# EasyEDA Pro project can-mcu.eprj, schematic host-dimmer-rgbw
Board Name: host-dimmer-rgbw; Create Date: 2026-08-16; Page Name: P1; Project Name: can-mcu; Schematic Name: host-dimmer-rgbw; Update Date: 2026-09-08; Company: EasyEDA.com; Page Size: A4; Version: V1.0
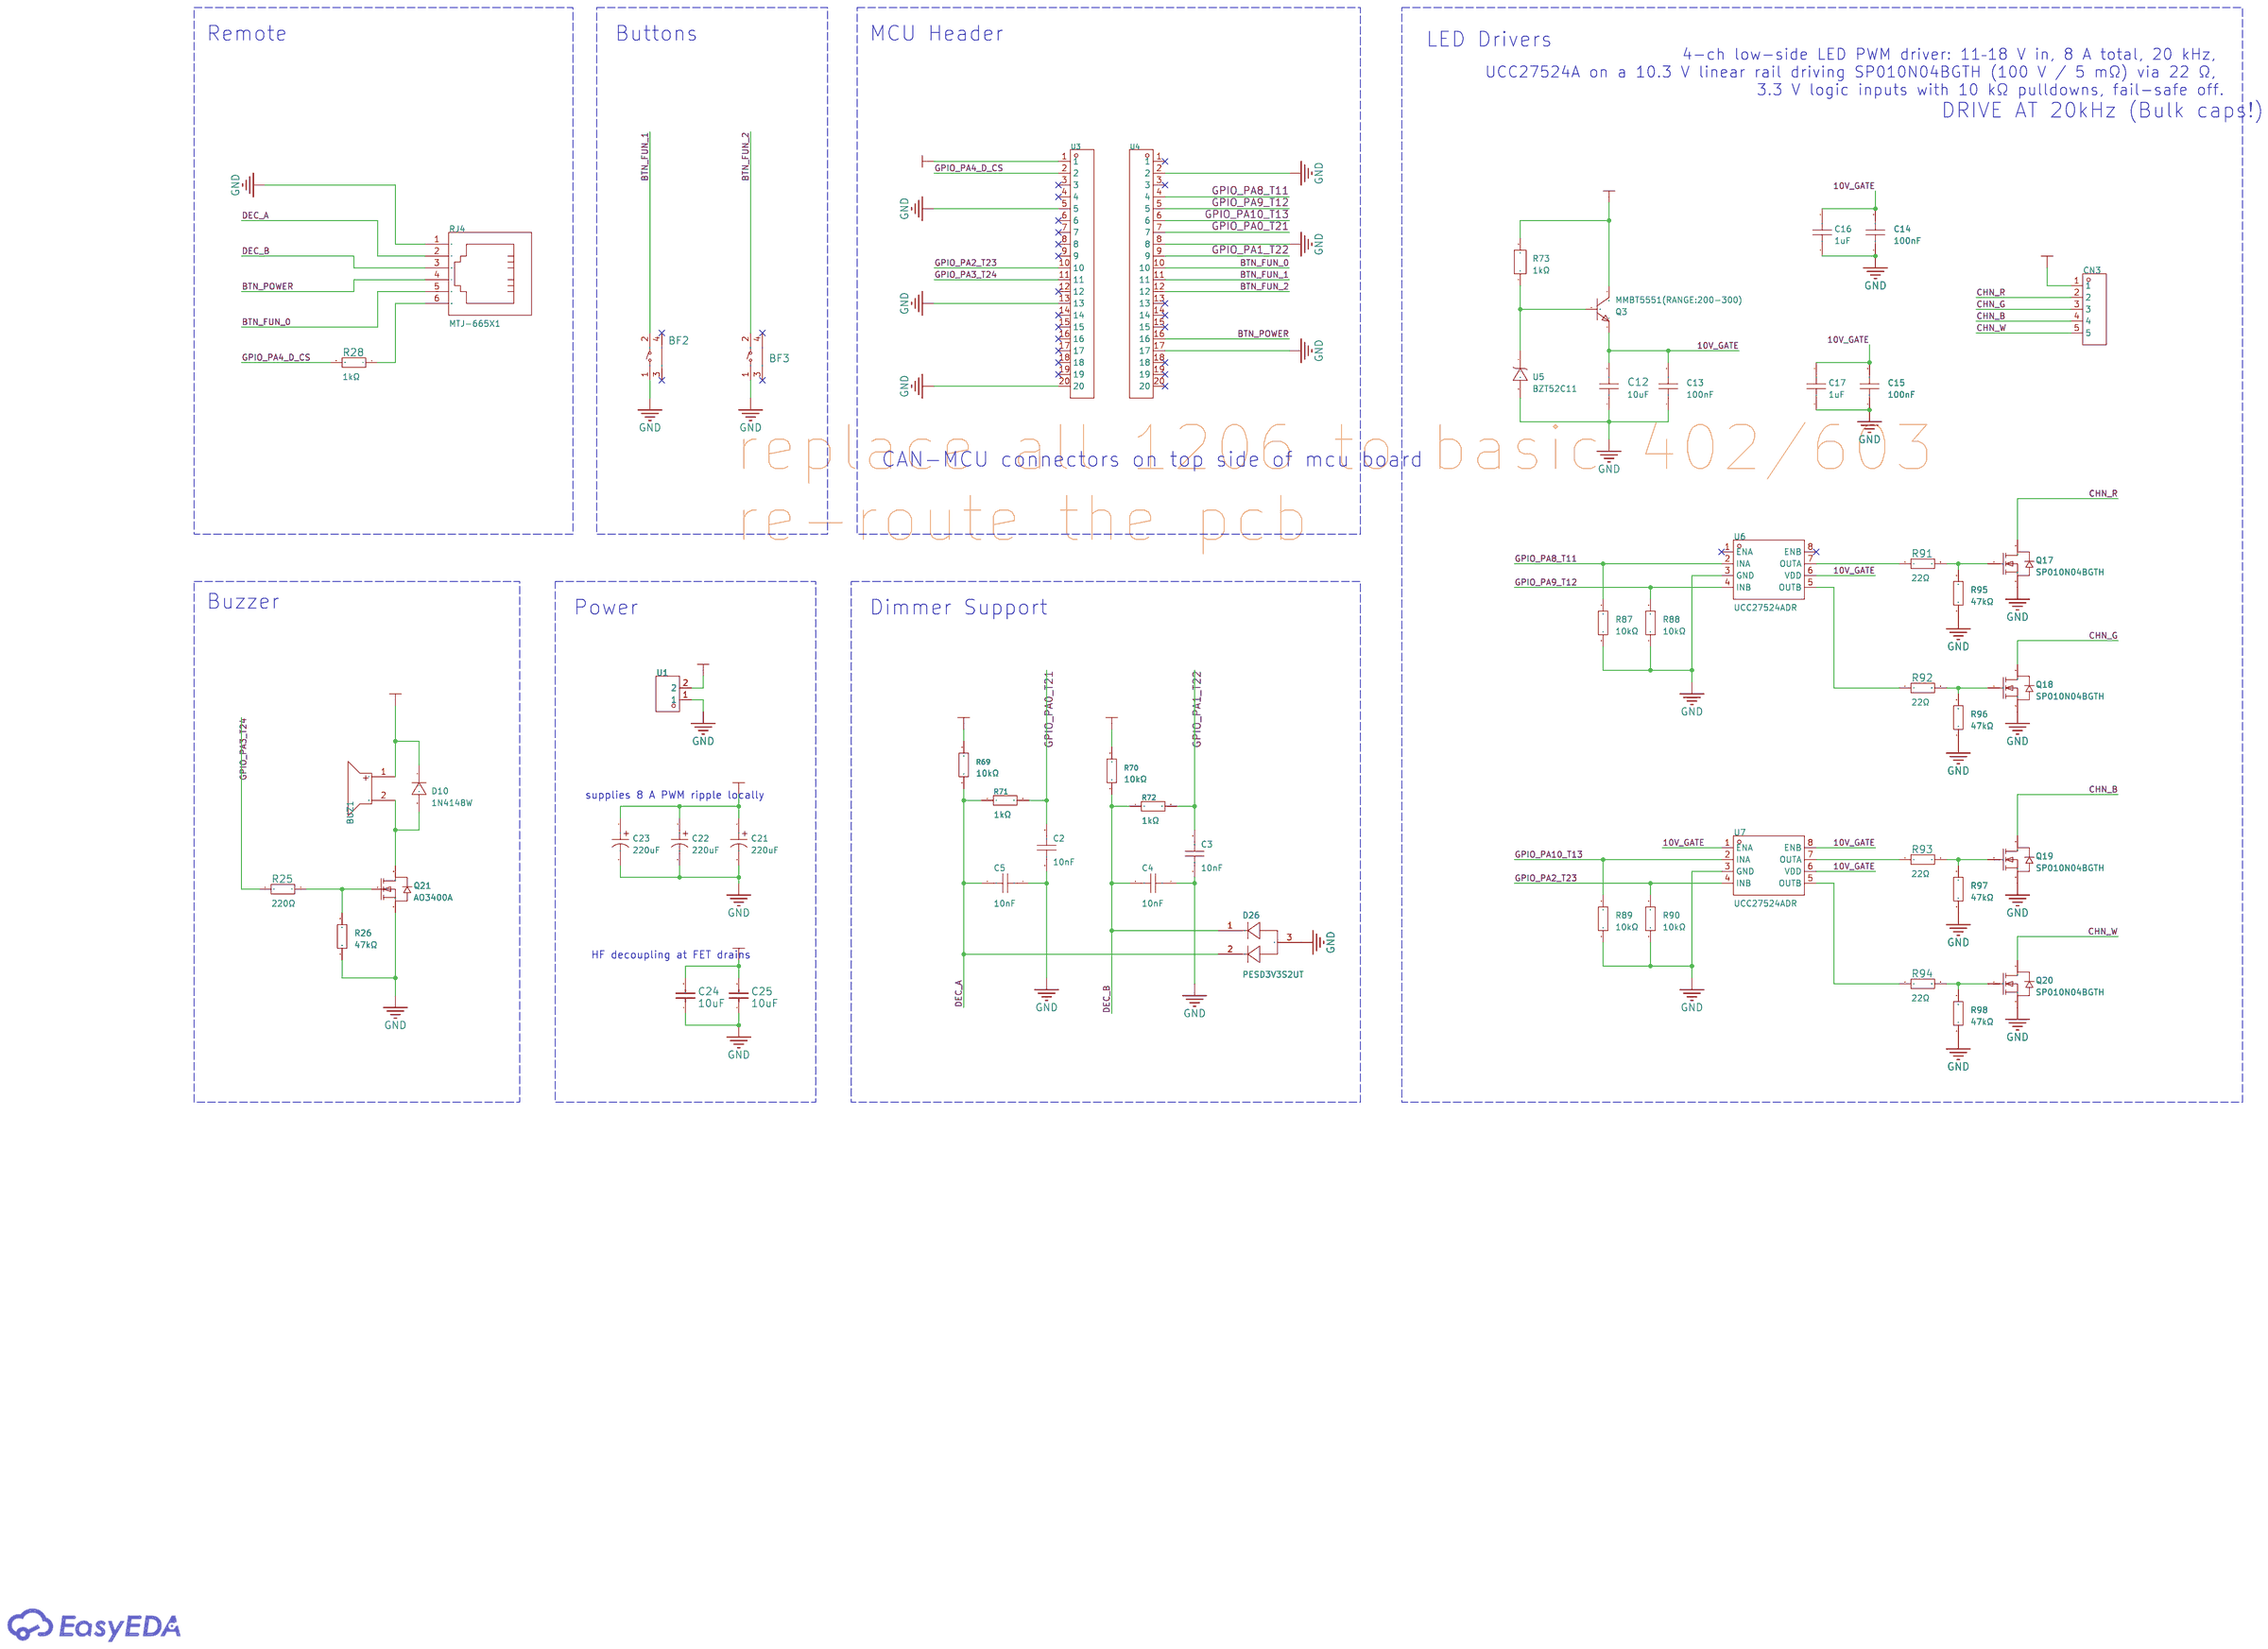
[diagram p3: schematic sheet]

## Parts
BF2  TC-6615-8-260G  [SW-TH_4P-L7.5-W8.0-P4.50]
BF3  TC-6615-8-260G  [SW-TH_4P-L7.5-W8.0-P4.50]
BUZ1  2.7kHz  [BUZ-TH_BD9.0-P4.00-D0.6-FD]
C2  10nF  [C1206]
C3  10nF  [C1206]
C4  10nF  [C1206]
C5  10nF  [C1206]
C12  10uF  [C0603]
C13  100nF  [C0603]
C14  100nF  [C0603]
C15  100nF  [C0603]
C16  1uF  [C0603]
C17  1uF  [C0603]
C21  220uF  [CAP-SMD_BD10.0-L10.3-W10.3-FD-1]
C22  220uF  [CAP-SMD_BD10.0-L10.3-W10.3-FD-1]
C23  220uF  [CAP-SMD_BD10.0-L10.3-W10.3-FD-1]
C24  10uF  [C1206]
C25  10uF  [C1206]
CN3  DB2ERC-5.08-5P-GN  [CONN-TH_5P-P5.08_DB2ERC-5.08-5P]
D10  1N4148W  [SOD-123_L2.8-W1.8-LS3.7-RD]
D26  PESD3V3S2UT  [SOT-23-3_L2.9-W1.3-P1.90-LS2.4-BR]
Q3  MMBT5551(RANGE:200-300)  [SOT-23-3_L2.9-W1.3-P1.90-LS2.4-BR]
Q17  SP010N04BGTH  [TO-252-3_L6.6-W6.1-P4.58-LS10.1-BR-2]
Q18  SP010N04BGTH  [TO-252-3_L6.6-W6.1-P4.58-LS10.1-BR-2]
Q19  SP010N04BGTH  [TO-252-3_L6.6-W6.1-P4.58-LS10.1-BR-2]
Q20  SP010N04BGTH  [TO-252-3_L6.6-W6.1-P4.58-LS10.1-BR-2]
Q21  AO3400A  [SOT-23-3_L2.9-W1.3-P1.90-LS2.4-BR]
R25  220Ω  [R1206]
R26  47kΩ  [R1206]
R28  1kΩ  [R1206]
R69  10kΩ  [R1206]
R70  10kΩ  [R1206]
R71  1kΩ  [R1206]
R72  1kΩ  [R1206]
R73  1kΩ  [R1206]
R87  10kΩ  [R0402]
R88  10kΩ  [R0402]
R89  10kΩ  [R0402]
R90  10kΩ  [R0402]
R91  22Ω  [R0402]
R92  22Ω  [R0402]
R93  22Ω  [R0402]
R94  22Ω  [R0402]
R95  47kΩ  [R0402]
R96  47kΩ  [R0402]
R97  47kΩ  [R0402]
R98  47kΩ  [R0402]
RJ4  MTJ-665X1  [RE45-TH_MTJ-665X1]
U1  PZ508V-11-02P-H25  [HDR-TH_2P-P5.08-V-M]
U3  KH-2.54FH-1X20P-H8.5  [HDR-TH_20P-P2.54-V-F-2]
U4  KH-2.54FH-1X20P-H8.5  [HDR-TH_20P-P2.54-V-F-2]
U5  BZT52C11  [SOD-123_L2.7-W1.6-LS3.7-RD-2]
U6  UCC27524ADR  [SOIC-8_L4.9-W3.9-P1.27-LS6.0-BL]
U7  UCC27524ADR  [SOIC-8_L4.9-W3.9-P1.27-LS6.0-BL]

## Library data of the parts
BF2 BF3 = TC-6615-8-260G: LCSC Part Name: 轻触6*6*8支架 插件260g; Supplier Part: C2845277; Manufacturer: HCTL(华灿天禄); Supplier Footprint: 插件; JLCPCB Part Class: Extended Part; Datasheet: https://item.szlcsc.com/datasheet/TC-6615-8-260G/3038944.html; Supplier: LCSC; Circuit: SPST; Actuator Style: Round Button; Operating Force: 2.6N; Mounting Type: Right Angle; Length: 6mm; Width: 6mm; Switch Height: 8mm; with Bracket: With Bracket; Contact Current: 50mA; Voltage Rating: 12V; Actuator/Cap Color: Black; With Lamp: No; Life: 100,000 Cycles; Operating Temperature: -25℃~+85℃
BUZ1 = QMB-09B-03: LCSC Part Name: 无源蜂鸣器QMB-09B-03; Supplier Part: C96256; Manufacturer: 华能; Supplier Footprint: 插件,D=9mm; Datasheet: https://item.szlcsc.com/datasheet/QMB-09B-03/97460.html; Supplier: LCSC; Driver Circuitry: Passive (Externally Driven); Technology: Electromagnetic; Voltage Rating: 3V; Voltage - Supply: 2V~5V; Current Consumption: 50mA; Sound Pressure Level(SPL): 85dB; Diameter(φD): 9mm; Height: 5.7mm; Operating Temperature: -20℃~+70℃
C2-C5 = FV31X103K102ECG: LCSC Part Name: 10nF ±10% 1kV; Supplier Part: C394163; Manufacturer: PSA(信昌电陶); Supplier Footprint: 1206; JLCPCB Part Class: Extended Part; Datasheet: https://item.szlcsc.com/datasheet/FV31X103K102ECG/373019.html; Supplier: LCSC; Tolerance: ±10%; Voltage Rating: 1kV; Temperature Coefficient: X7R
C12 = CL10A106MA8NRNC: LCSC Part Name: 10uF ±20% 25V; Supplier Part: C96446; Manufacturer: SAMSUNG(三星); Supplier Footprint: 0603; Datasheet: https://item.szlcsc.com/datasheet/CL10A106MA8NRNC/97651.html; Supplier: LCSC; Tolerance: ±20%; Voltage Rating: 25V; Temperature Coefficient: X5R
C13-C15 = CC0603KRX7R9BB104: Capacitance:100nF Tolerance:±10% Tolerance:±10% Voltage Rating:50V Temperature Coefficient:X7R; LCSC Part Name: 100nF ±10% 50V; Supplier Part: C14663; Manufacturer: YAGEO(国巨); Supplier Footprint: 0603; JLCPCB Part Class: Basic Part; Datasheet: https://item.szlcsc.com/datasheet/CC0603KRX7R9BB104/15331.html; Supplier: LCSC; Tolerance: ±10%; Voltage Rating: 50V; Temperature Coefficient: X7R
C16 C17 = CL10A105KB8NNNC: Capacitance:1uF Tolerance:±10% Tolerance:±10% Voltage Rating:50V Temperature Coefficient:X5R; LCSC Part Name: 1uF ±10% 50V; Supplier Part: C15849; Manufacturer: SAMSUNG(三星); Supplier Footprint: 0603; JLCPCB Part Class: Basic Part; Datasheet: https://item.szlcsc.com/datasheet/CL10A105KB8NNNC/16531.html; Supplier: LCSC; Tolerance: ±10%; Voltage Rating: 50V; Temperature Coefficient: X5R
C21-C23 = MA50V220M10x10: LCSC Part Name: 220uF ±20% 50V; Supplier Part: C46550473; Manufacturer: JIERR(捷而瑞); Supplier Footprint: SMD,D10xL10mm; Datasheet: https://item.szlcsc.com/datasheet/MA50V220M10x10/48680167.html; Supplier: LCSC; Tolerance: ±20%; Voltage Rating: 50V; Ripple Current: 3.1A@100kHz; Equivalent Series Resistance(ESR): 30mΩ@100kHz; Type: Polymer; Diameter: 10mm; Height - Seated (Max): 10mm; Lifetime: 2000hrs@105℃; Operating Temperature: -55℃~+105℃; Polarity type: 有极性
C24 C25 = CL31A106KBHNNNE: LCSC Part Name: 10uF ±10% 50V; Supplier Part: C13585; Manufacturer: SAMSUNG(三星); Supplier Footprint: 1206; Datasheet: https://item.szlcsc.com/datasheet/CL31A106KBHNNNE/14236.html; Supplier: LCSC; Tolerance: ±10%; Voltage Rating: 50V; Temperature Coefficient: X5R
CN3 = DB2ERC-5.08-5P-GN: LCSC Part Name: 1x5P 5.08mm 排数:1 每排P数:5; Supplier Part: C395760; Manufacturer: DORABO(地博电气); Supplier Footprint: 弯插,P=5.08mm; JLCPCB Part Class: Extended Part; Datasheet: https://item.szlcsc.com/datasheet/DB2ERC-5.08-5P-GN/376507.html; Supplier: LCSC; Connector Type: Board Side/Socket - Closed; Number of Positions or Pins: 1x5P; Pitch: 5.08mm; Color: Green; Mounting Type: Right-Angle; Number of Pins: 5P; Number of Rows: 1; Number of PINs Per Row: 5; Current Rating: 15A; Voltage Rating (Max): 630V; Operating Temperature: -40℃~+105℃
D10 = 1N4148W_C2099: LCSC Part Name: 丝印T4 100V 150mA; Supplier Part: C2099; Manufacturer: CJ(江苏长电/长晶); Supplier Footprint: SOD-123; JLCPCB Part Class: Extended Part; Datasheet: https://item.szlcsc.com/datasheet/1N4148W/2456.html; Supplier: LCSC; Diode Configuration: Standalone; Pd - Power Dissipation: 500mW; Current - Rectified: 150mA; Voltage - DC Reverse(Vr): 100V; Voltage - Forward(Vf@If): 1.25V@150mA; Non-Repetitive Peak Forward Surge Current: 2A; Reverse Leakage Current (Ir): 1uA@75V; Reverse Recovery Time (trr): 4ns
D26 = PESD3V3S2UT_C2687120: Supplier Part: C2687120; Manufacturer: UMW(友台半导体); Supplier Footprint: SOT-23; Datasheet: https://atta.szlcsc.com/upload/public/pdf/source/20231109/FA9807058B22500FF1E22196126D0E67.pdf; Supplier: LCSC
Q3 = MMBT5551(RANGE:200-300): LCSC Part Name: hfe=200~300; Supplier Part: C2145; Manufacturer: CJ(江苏长电/长晶); Supplier Footprint: SOT-23; Datasheet: https://atta.szlcsc.com/upload/public/pdf/source/20140321/1457707027001.pdf; Supplier: LCSC; type: NPN; Collector - Emitter Voltage VCEO: 160V; Pd - Power Dissipation: 300mW; DC Current Gain: 200@10mA,5V; Transition frequency(fT): 100MHz; Current - Collector Cutoff: 50nA; Vce Saturation(VCE(sat)): 150mV; Operating Temperature: -55℃~+150℃
Q17-Q20 = SP010N04BGTH: LCSC Part Name: N沟道 耐压:100V 电流:120A; Supplier Part: C22385380; Manufacturer: Siliup(矽普); Supplier Footprint: TO-252; Datasheet: https://item.szlcsc.com/datasheet/SP010N04BGTH/23937226.html; Supplier: LCSC; Drain to Source Voltage: 100V; Current - Continuous Drain(Id): 120A; RDS(on): 5mΩ@10V；6.5mΩ@4.5V; Pd - Power Dissipation: 160W; Gate Threshold Voltage (Vgs(th)): 1.7V@250uA; Gate Charge(Qg): 42nC@10V; Input Capacitance(Ciss): 2.97nF; Reverse Transfer Capacitance (Crss@Vds): 24pF; Operating Temperature: -55℃~+150℃; Type: N-Channel; Output Capacitance(Coss): 1.125nF
Q21 = AO3400A: LCSC Part Name: 1个N沟道 耐压:30V 电流:5.2A; Supplier Part: C700953; Manufacturer: HUASHUO(华朔); Supplier Footprint: SOT-23; Datasheet: https://item.szlcsc.com/datasheet/AO3400A/736021.html; Supplier: LCSC; Number: 1 N-channel; Drain to Source Voltage: 30V; Current - Continuous Drain(Id): 5.2A; RDS(on): 27mΩ@4.5V; Pd - Power Dissipation: 1W; Gate Threshold Voltage (Vgs(th)): 850mV; Gate Charge(Qg): 11.7nC@4.5V; Input Capacitance(Ciss): 927pF; Reverse Transfer Capacitance (Crss@Vds): 61pF; Operating Temperature: -55℃~+150℃; Type: N-Channel; Vgs: ±12V
R25 = FRC1206J221 TS: Type:Thick Film Resistor Resistance:220Ω Tolerance:±5% Tolerance:±5% Power(Watts):250mW Voltage-Supply(Max):200V Temperature Coefficient:±100ppm/℃ Temperature Coefficient:±100ppm/℃ Operating Temperature:-55℃~+155℃ Operating Temperature:-55℃~+155℃; LCSC Part Name: 220Ω ±5% 250mW 厚膜电阻; Supplier Part: C2933785; Manufacturer: FOJAN(富捷); Supplier Footprint: 1206; JLCPCB Part Class: Extended Part; Datasheet: https://item.szlcsc.com/datasheet/FRC1206J221%2520TS/3279887.html; Supplier: LCSC; Type: Thick Film Resistor; Tolerance: ±5%; Power(Watts): 250mW; Voltage-Supply(Max): 200V; Temperature Coefficient: ±100ppm/℃; Operating Temperature: -55℃~+155℃
R26 = RC1206FR-0747KL: Type:Thick Film Resistor Resistance:47kΩ Tolerance:±1% Tolerance:±1% Power(Watts):250mW Voltage-Supply(Max):200V Temperature Coefficient:±100ppm/℃ Temperature Coefficient:±100ppm/℃ Operating Temperature:-55℃~+155℃ Operating Temperature:-55℃~+155℃; LCSC Part Name: 厚膜电阻 47kΩ ±1% 250mW; Supplier Part: C137270; Manufacturer: YAGEO(国巨); Supplier Footprint: 1206; JLCPCB Part Class: Extended Part; Datasheet: https://item.szlcsc.com/datasheet/RC1206FR-0747KL/148586.html; Supplier: LCSC; Type: Thick Film Resistor; Tolerance: ±1%; Power(Watts): 250mW; Voltage-Supply(Max): 200V; Temperature Coefficient: ±100ppm/℃; Operating Temperature: -55℃~+155℃
R28 = 1206W4F1001T5E_C4410: Type:Thick Film Resistor Resistance:1kΩ Tolerance:±1% Tolerance:±1% Power(Watts):250mW Voltage-Supply(Max):200V Temperature Coefficient:±100ppm/℃ Temperature Coefficient:±100ppm/℃ Operating Temperature:-55℃~+155℃ Operating Temperature:-55℃~+155℃; LCSC Part Name: 1kΩ ±1% 250mW 厚膜电阻; Supplier Part: C4410; Manufacturer: UNI-ROYAL(厚声); Manufacturer Part: 1206W4F1001T5E; Supplier Footprint: 1206; JLCPCB Part Class: Basic Part; Datasheet: https://item.szlcsc.com/datasheet/1206W4F1001T5E/4817.html; Supplier: LCSC; Type: Thick Film Resistor; Tolerance: ±1%; Power(Watts): 250mW; Voltage-Supply(Max): 200V; Temperature Coefficient: ±100ppm/℃; Operating Temperature: -55℃~+155℃
R69 R70 = 1206W4F1002T5E: LCSC Part Name: 10kΩ ±1% 250mW 厚膜电阻; Supplier Part: C17902; Manufacturer: UNI-ROYAL(厚声); Supplier Footprint: 1206; JLCPCB Part Class: Basic Part; Datasheet: https://item.szlcsc.com/datasheet/1206W4F1002T5E/18590.html; Supplier: LCSC; Type: Thick Film Resistor; Tolerance: ±1%; Power(Watts): 250mW; Voltage-Supply(Max): 200V; Temperature Coefficient: ±100ppm/℃; Operating Temperature: -55℃~+155℃
R71 R72 = 1206W4F1001T5E_C4410: LCSC Part Name: 1kΩ ±1% 250mW 厚膜电阻; Supplier Part: C4410; Manufacturer: UNI-ROYAL(厚声); Manufacturer Part: 1206W4F1001T5E; Supplier Footprint: 1206; JLCPCB Part Class: Basic Part; Datasheet: https://item.szlcsc.com/datasheet/1206W4F1001T5E/4817.html; Supplier: LCSC; Type: Thick Film Resistor; Tolerance: ±1%; Power(Watts): 250mW; Voltage-Supply(Max): 200V; Temperature Coefficient: ±100ppm/℃; Operating Temperature: -55℃~+155℃
R73 = FRC1206J102 TS: LCSC Part Name: 1kΩ ±5% 250mW 厚膜电阻; Supplier Part: C2907440; Manufacturer: FOJAN(富捷); Supplier Footprint: 1206; JLCPCB Part Class: Extended Part; Supplier: LCSC; Type: Thick Film Resistor; Tolerance: ±5%; Power(Watts): 250mW; Voltage-Supply(Max): 200V; Temperature Coefficient: ±100ppm/℃; Operating Temperature: -55℃~+155℃
R87-R90 = 0402WGF1002TCE: LCSC Part Name: 10kΩ ±1% 62.5mW 厚膜电阻; Supplier Part: C25744; Manufacturer: UNI-ROYAL(厚声); Supplier Footprint: 0402; JLCPCB Part Class: Basic Part; Datasheet: https://item.szlcsc.com/datasheet/0402WGF1002TCE/26487.html; Supplier: LCSC; Type: Thick Film Resistor; Tolerance: ±1%; Power(Watts): 62.5mW; Voltage-Supply(Max): 50V; Temperature Coefficient: ±100ppm/℃; Operating Temperature: -55℃~+155℃
R91-R94 = 0402WGF220JTCE: LCSC Part Name: 22Ω ±1% 62.5mW 厚膜电阻; Supplier Part: C25092; Manufacturer: UNI-ROYAL(厚声); Supplier Footprint: 0402; JLCPCB Part Class: Basic Part; Datasheet: https://atta.szlcsc.com/upload/public/pdf/source/20200306/C422600_1E6D84923E4A46A82E41ADD87F860B5C.pdf; Supplier: LCSC; Type: Thick Film Resistors; Tolerance: ±1%; Temperature Coefficient: ±100ppm/℃; Operating Temperature Range: -55℃~+155℃
R95-R98 = 0402WGF4702TCE: LCSC Part Name: 47kΩ ±1% 62.5mW 厚膜电阻; Supplier Part: C25792; Manufacturer: UNI-ROYAL(厚声); Supplier Footprint: 0402; Datasheet: https://item.szlcsc.com/datasheet/0402WGF4702TCE/26535.html; Supplier: LCSC; Type: Thick Film Resistor; Tolerance: ±1%; Power(Watts): 62.5mW; Voltage-Supply(Max): 50V; Temperature Coefficient: ±100ppm/℃; Operating Temperature: -55℃~+155℃
RJ4 = MTJ-665X1: LCSC Part Name: 不带LED; Supplier Part: C6685902; Manufacturer: ADAM TECH; Supplier Footprint: 插件; JLCPCB Part Class: Extended Part; Datasheet: https://atta.szlcsc.com/upload/public/pdf/source/20231023/mtj-665x1-data-sheet.pdf-04da632e217364e13f6f42d37e7634a5.pdf; Supplier: LCSC; Number of Ports: 1; LED: Without LED; Shielding: Unshielded; Contact Material: Phosphor Bronze; Contact Plating: Gold; Operating Temperature Range: -40℃~+85℃
U1 = PZ508V-11-02P-H25: LCSC Part Name: 1x2P 间距:5.08mm 方针 直插; Supplier Part: C25170858; Manufacturer: XFCN(兴飞); Supplier Footprint: 插件,P=5.08mm; JLCPCB Part Class: Extended Part; Datasheet: https://item.szlcsc.com/datasheet/PZ508V-11-02P-H25/26900548.html; Supplier: LCSC; Pin Structure: 1x2P; Pitch: 5.08mm; Circluar Pins/Square Pins: Pin Header; Mounting Type: Through Hole; Number of Rows: 1; Number of Pins: 2P; Current Rating: 7A; Length of Mating Pin: 8mm; Insulation Height: 2.5mm; Length of End Connection Pin: 3.5mm; Contact Material: Brass; Operating Temperature: -40℃~+105℃
U3 U4 = KH-2.54FH-1X20P-H8.5: LCSC Part Name: 间距:2.54mm 1x20P 直插; Supplier Part: C2905423; Manufacturer: kinghelm(金航标); Supplier Footprint: 插件,P=2.54mm; Datasheet: https://item.szlcsc.com/datasheet/KH-2.54FH-1X20P-H8.5/3175197.html; Supplier: LCSC; Holes Structure: 1x20P; Pitch: 2.54mm; Circular Hole / Square Hole: Square Hole; Mounting Type: Through Hole; Number of Rows: 1; Number of Positions: 20P; Current Rating: 3A; Holes Direction: Top; Insulation Height: 8.5mm; Operating Temperature: -40℃~+105℃
U5 = BZT52C11_C2932743: LCSC Part Name: 独立式 耐压:11V 电流:0.1uA@8V; Supplier Part: C2932743; Manufacturer: GOODWORK(固得沃克); Supplier Footprint: SOD-123; Datasheet: https://item.szlcsc.com/datasheet/BZT52C11/3278300.html; Supplier: LCSC; Diode Configuration: 1 Independent; Zener Voltage(Nom): 11V; Reverse Leakage Current (Ir): 100nA@8V; Zener Voltage(Range): 10.4V~11.6V; Pd - Power Dissipation: 500mW; Impedance(Zzt): 20Ω; Impedance(Zzk): 150Ω; Operating Junction Temperature Range: -65℃~+150℃
U6 U7 = UCC27524ADR: LCSC Part Name: 具备负输入电压能力的双路5A高速低侧栅极驱动器; Supplier Part: C185857; Manufacturer: TI(德州仪器); Supplier Footprint: SOIC-8; Datasheet: https://www.ti.com/cn/lit/gpn/ucc27524a; Supplier: LCSC; Driven Configuration: Low Side; Load Type: IGBT；MOSFET; Number of Drivers: 2; Current - Output Low(IOL): 5A; Current - Output High(IOH): 5A; Voltage - Supply: 4.5V~18V; Rise Time: 7ns; Fall Time: 9ns; Features: Under Voltage Protection; Operating Temperature: -40℃~+140℃; Input Logic Level - High: 1.9V~2.3V; Input Logic Level - Low: 1V~1.4V

## Nets
10V_GATE: C12.2 C13.2 C14.2 C15.2 C16.2 C17.2 Q3.2(E) U6.6(VDD) U7.1(ENA) U7.6(VDD) U7.8(ENB)
+3V3: BUZ1.1 D10.1(K) R69.2 R70.2 U3.1
+12V: C21.1 C22.1 C23.1 C24.2 C25.2 CN3.1 Q3.3(C) R73.2 U1.2
GND: BF2.1 BF3.1 C2.1 C3.1 C4.1 C5.1 C12.1 C13.1 C14.1 C15.1 C16.1 C17.1 C21.2 C22.2 C23.2 C24.1 C25.1 D26.3 Q17.3(S) Q18.3(S) Q19.3(S) Q20.3(S) Q21.2(S) R26.1 R87.1 R88.1 R89.1 R90.1 R95.1 R96.1 R97.1 R98.1 RJ4.1 U1.1 U3.5 U3.13 U3.20 U4.2 U4.8 U4.17 U5.2 U6.3(GND) U7.3(GND)
BTN_FUN_0: RJ4.5 U4.10
BTN_FUN_1: BF2.2 U4.11
BTN_FUN_2: BF3.2 U4.12
BTN_POWER: RJ4.4 U4.16
CHN_B: CN3.4 Q19.2(D)
CHN_G: CN3.3 Q18.2(D)
CHN_R: CN3.2 Q17.2(D)
CHN_W: CN3.5 Q20.2(D)
DEC_A: C5.2 D26.2 R69.1 R71.1 RJ4.2
DEC_B: C4.2 D26.1 R70.1 R72.1 RJ4.3
GPIO_PA0_T21: C2.2 R71.2 U4.7
GPIO_PA1_T22: C3.2 R72.2 U4.9
GPIO_PA2_T23: R90.2 U3.10 U7.4(INB)
GPIO_PA3_T24: R25.1 U3.11
GPIO_PA4_D_CS: R28.2 U3.2
GPIO_PA8_T11: R87.2 U4.4 U6.2(INA)
GPIO_PA9_T12: R88.2 U4.5 U6.4(INB)
GPIO_PA10_T13: R89.2 U4.6 U7.2(INA)
$1N13717: R28.1 RJ4.6
Net-(BUZ1-2): BUZ1.2 D10.2(A) Q21.3(D)
Net-(Q3-1): Q3.1(B) R73.1 U5.1
Net-(Q17-1): Q17.1(G) R91.2 R95.2
Net-(Q18-1): Q18.1(G) R92.2 R96.2
Net-(Q19-1): Q19.1(G) R93.2 R97.2
Net-(Q20-1): Q20.1(G) R94.2 R98.2
Net-(Q21-1): Q21.1(G) R25.2 R26.2
Net-(R91-1): R91.1 U6.7(OUTA)
Net-(R92-1): R92.1 U6.5(OUTB)
Net-(R93-1): R93.1 U7.7(OUTA)
Net-(R94-1): R94.1 U7.5(OUTB)

Not connected (* = marked no-connect by the designer): BF2 3* 4*; BF3 3* 4*; U3 3* 4* 6* 7* 8* 9* 12* 14* 15* 16* 17* 18* 19*; U4 1* 3* 13* 14* 15* 18* 19* 20*; U6 1(ENA)* 8(ENB)*

## Notes on the sheet
- Remote
- Buttons
- MCU Header
- LED Drivers
- 4-ch low-side LED PWM driver: 11–18 V in, 8 A total, 20 kHz,
  UCC27524A on a 10.3 V linear rail driving SP010N04BGTH (100 V / 5 mΩ) via 22 Ω,
  3.3 V logic inputs with 10 kΩ pulldowns, fail-safe off.
- DRIVE AT 20kHz (Bulk caps!)
- CAN-MCU connectors on top side of mcu board
- replace all 1206 to basic 402/603
  re-route the pcb
- Buzzer
- Power
- Dimmer Support
- supplies 8 A PWM ripple locally
- HF decoupling at FET drains
